# EAGLE schematic MSP-EXP430FR5994_EagleCAD (EAGLE 7.2.0)
DRAWN: Mike Stein; REV: 1.1

## Sheet 1 of 7
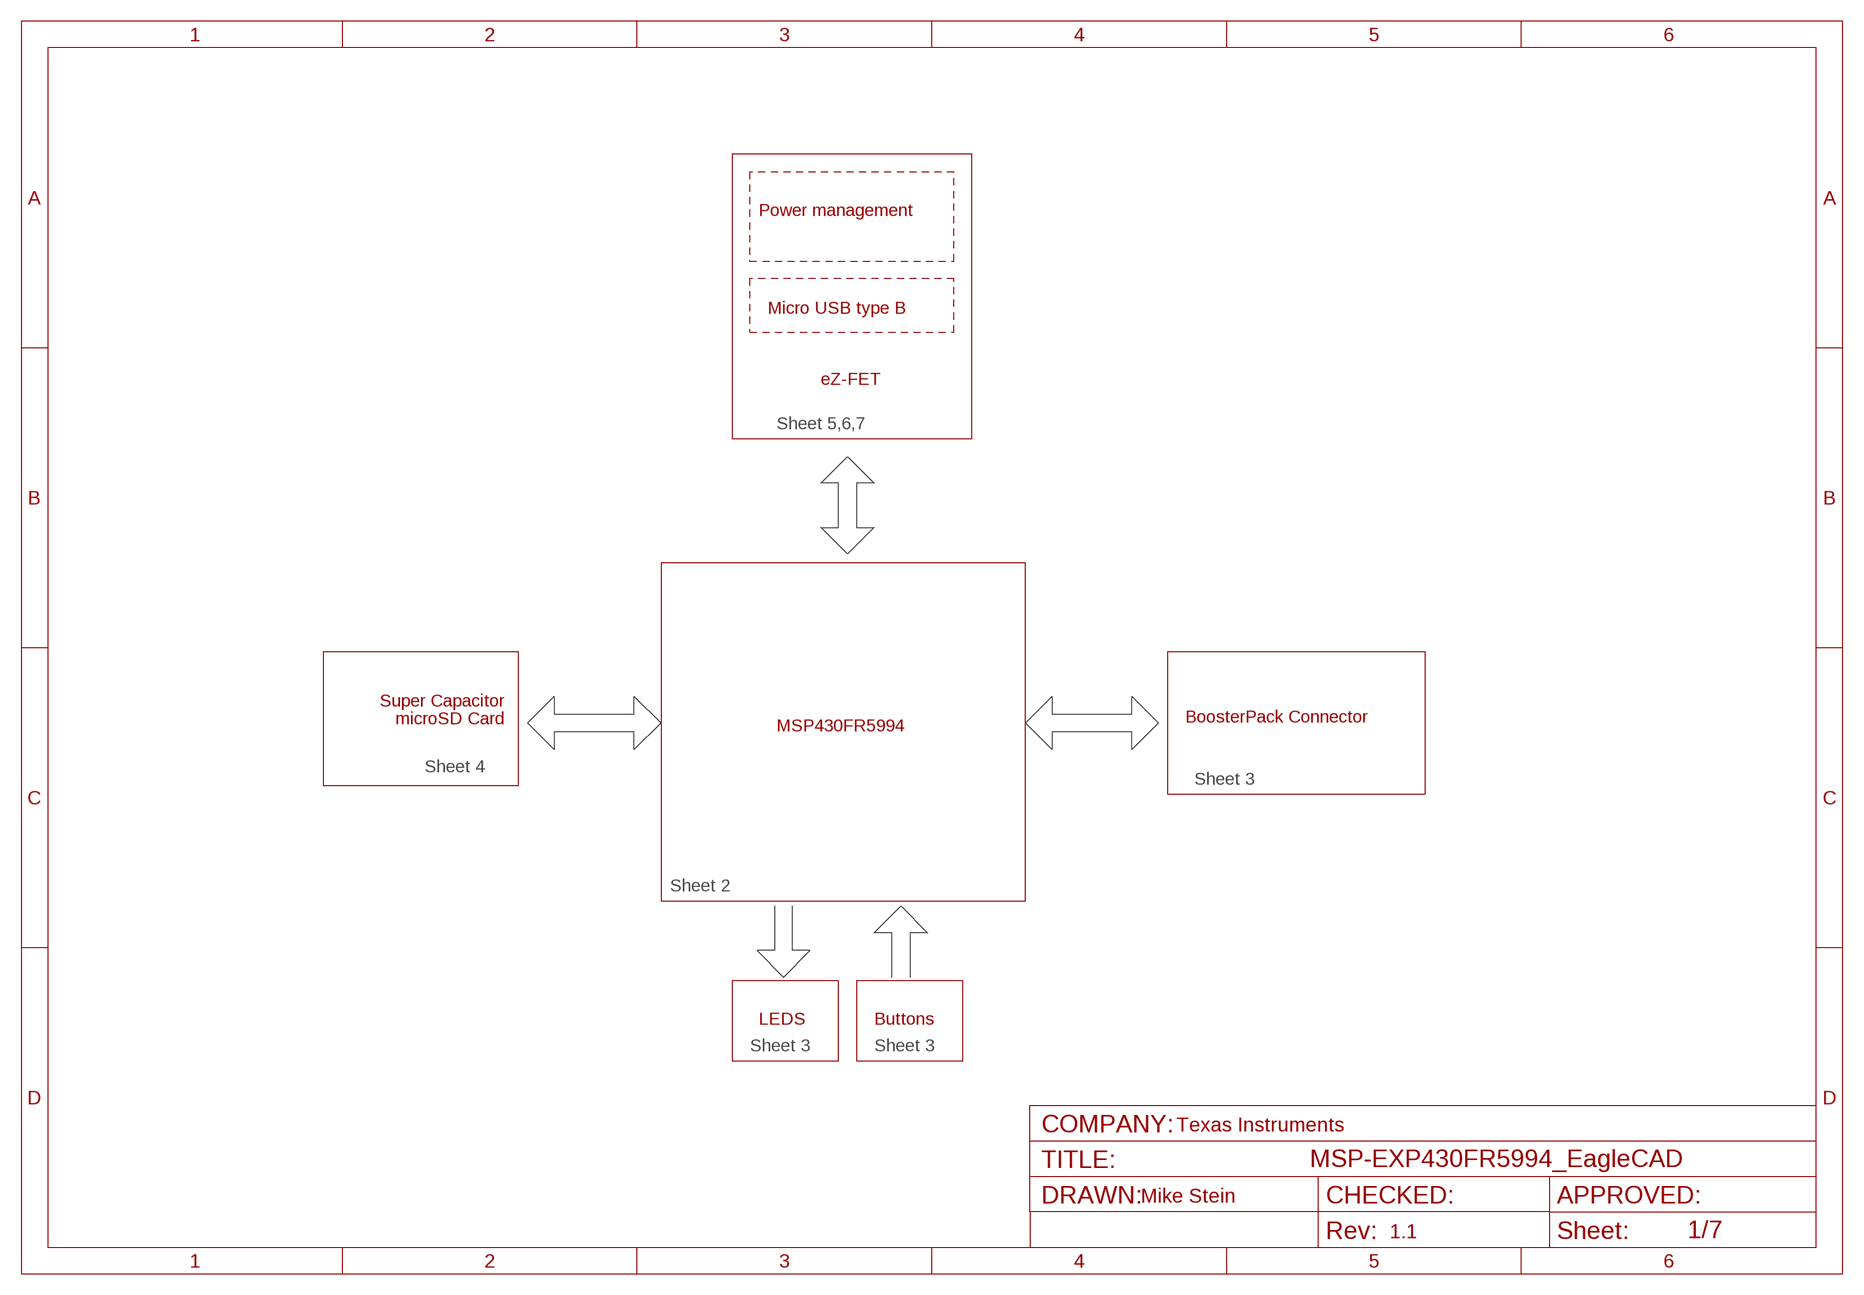
[diagram p0: schematic, sheet 1]

### Notes on the sheet
- Power management
- Micro USB type B
- eZ-FET
- Sheet 5,6,7
- Super Capacitor
- microSD Card
- BoosterPack Connector
- MSP430FR5994
- Sheet 4
- Sheet 3
- Sheet 2
- LEDS | Buttons
- Sheet 3 | Sheet 3
- Texas Instruments

## Sheet 2 of 7
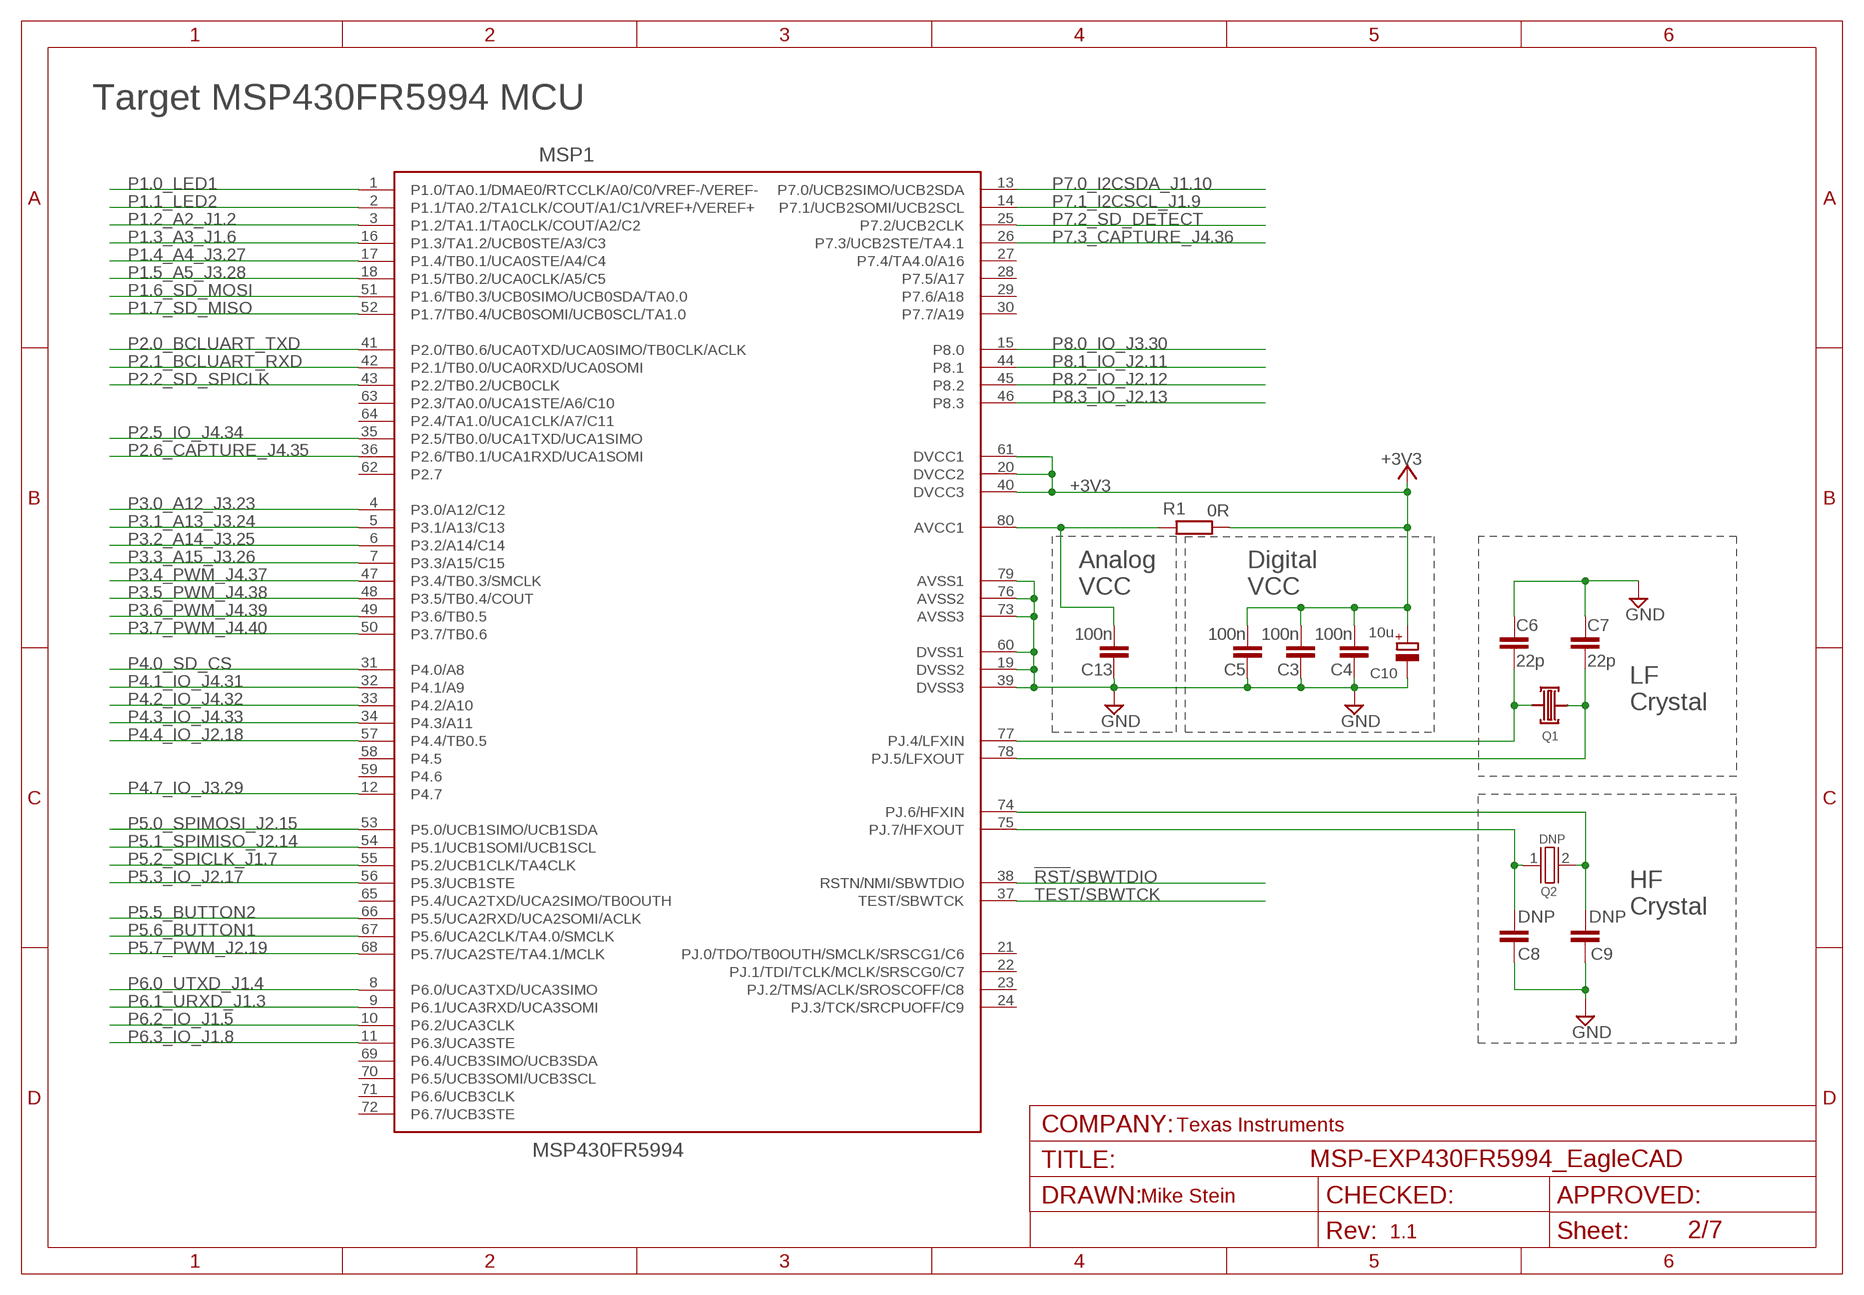
[diagram p1: schematic, sheet 2]

### Parts
C3  100n  C-EUCM0402  [0402]
C4  100n  C-EUCM0402  [0402]
C5  100n  C-EUCM0402  [0402]
C6  22p  C-EUCM0402  [0402]
C7  22p  C-EUCM0402  [0402]
C8  DNP  C-EUCM0402  [0402]
C9  DNP  C-EUCM0402  [0402]
C10  10u  CPOL-EUA/3216-18R  [A/3216-18R]
C13  100n  C-EUCM0402  [0402]
MSP1  MSP430FR5994  [PN80]
Q1  LF_CRYSTAL  [LF_CRYSTAL]
Q2  CRYSTALHF_GENERAL  [HF_XTAL]
R1  0R  R-EU_RM0402  [0402]

### Nets
!RST!/SBWTDIO: MSP1.38(RSTN/NMI/SBWTDIO) ; also sheet 3,6
+3V3: C3.1 C4.1 C5.1 C10.+ MSP1.20(DVCC2) MSP1.40(DVCC3) MSP1.61(DVCC1) R1.1 ; also sheet 3,4,6
N$2: C13.1 MSP1.80(AVCC1) R1.2
N$8: C7.1 MSP1.78(PJ.5/LFXOUT) Q1.2
N$10: C9.1 MSP1.74(PJ.6/HFXIN) Q2.2
N$11: C8.1 MSP1.75(PJ.7/HFXOUT) Q2.1
N$14: C6.1 MSP1.77(PJ.4/LFXIN) Q1.1
P1.0_LED1: MSP1.1(P1.0/TA0.1/DMAE0/RTCCLK/A0/C0/VREF-/VEREF-) ; also sheet 3
P1.1_LED2: MSP1.2(P1.1/TA0.2/TA1CLK/COUT/A1/C1/VREF+/VEREF+) ; also sheet 3
P1.2_A2_J1.2: MSP1.3(P1.2/TA1.1/TA0CLK/COUT/A2/C2) ; also sheet 3
P1.3_A3_J1.6: MSP1.16(P1.3/TA1.2/UCB0STE/A3/C3) ; also sheet 3
P1.4_A4_J3.27: MSP1.17(P1.4/TB0.1/UCA0STE/A4/C4) ; also sheet 3
P1.5_A5_J3.28: MSP1.18(P1.5/TB0.2/UCA0CLK/A5/C5) ; also sheet 3
P1.6_SD_MOSI: MSP1.51(P1.6/TB0.3/UCB0SIMO/UCB0SDA/TA0.0) ; also sheet 4
P1.7_SD_MISO: MSP1.52(P1.7/TB0.4/UCB0SOMI/UCB0SCL/TA1.0) ; also sheet 4
P2.0_BCLUART_TXD: MSP1.41(P2.0/TB0.6/UCA0TXD/UCA0SIMO/TB0CLK/ACLK) ; also sheet 6
P2.1_BCLUART_RXD: MSP1.42(P2.1/TB0.0/UCA0RXD/UCA0SOMI) ; also sheet 6
P2.2_SD_SPICLK: MSP1.43(P2.2/TB0.2/UCB0CLK) ; also sheet 4
P2.5_IO_J4.34: MSP1.35(P2.5/TB0.0/UCA1TXD/UCA1SIMO) ; also sheet 3
P2.6_CAPTURE_J4.35: MSP1.36(P2.6/TB0.1/UCA1RXD/UCA1SOMI) ; also sheet 3
P3.0_A12_J3.23: MSP1.4(P3.0/A12/C12) ; also sheet 3
P3.1_A13_J3.24: MSP1.5(P3.1/A13/C13) ; also sheet 3
P3.2_A14_J3.25: MSP1.6(P3.2/A14/C14) ; also sheet 3
P3.3_A15_J3.26: MSP1.7(P3.3/A15/C15) ; also sheet 3
P3.4_PWM_J4.37: MSP1.47(P3.4/TB0.3/SMCLK) ; also sheet 3
P3.5_PWM_J4.38: MSP1.48(P3.5/TB0.4/COUT) ; also sheet 3
P3.6_PWM_J4.39: MSP1.49(P3.6/TB0.5) ; also sheet 3
P3.7_PWM_J4.40: MSP1.50(P3.7/TB0.6) ; also sheet 3
P4.0_SD_CS: MSP1.31(P4.0/A8) ; also sheet 4
P4.1_IO_J4.31: MSP1.32(P4.1/A9) ; also sheet 3
P4.2_IO_J4.32: MSP1.33(P4.2/A10) ; also sheet 3
P4.3_IO_J4.33: MSP1.34(P4.3/A11) ; also sheet 3
P4.4_IO_J2.18: MSP1.57(P4.4/TB0.5) ; also sheet 3
P4.7_IO_J3.29: MSP1.12(P4.7) ; also sheet 3
P5.0_SPIMOSI_J2.15: MSP1.53(P5.0/UCB1SIMO/UCB1SDA) ; also sheet 3
P5.1_SPIMISO_J2.14: MSP1.54(P5.1/UCB1SOMI/UCB1SCL) ; also sheet 3
P5.2_SPICLK_J1.7: MSP1.55(P5.2/UCB1CLK/TA4CLK) ; also sheet 3
P5.3_IO_J2.17: MSP1.56(P5.3/UCB1STE) ; also sheet 3
P5.5_BUTTON2: MSP1.66(P5.5/UCA2RXD/UCA2SOMI/ACLK) ; also sheet 3
P5.6_BUTTON1: MSP1.67(P5.6/UCA2CLK/TA4.0/SMCLK) ; also sheet 3
P5.7_PWM_J2.19: MSP1.68(P5.7/UCA2STE/TA4.1/MCLK) ; also sheet 3
P6.0_UTXD_J1.4: MSP1.8(P6.0/UCA3TXD/UCA3SIMO) ; also sheet 3
P6.1_URXD_J1.3: MSP1.9(P6.1/UCA3RXD/UCA3SOMI) ; also sheet 3
P6.2_IO_J1.5: MSP1.10(P6.2/UCA3CLK) ; also sheet 3
P6.3_IO_J1.8: MSP1.11(P6.3/UCA3STE) ; also sheet 3
P7.0_I2CSDA_J1.10: MSP1.13(P7.0/UCB2SIMO/UCB2SDA) ; also sheet 3
P7.1_I2CSCL_J1.9: MSP1.14(P7.1/UCB2SOMI/UCB2SCL) ; also sheet 3
P7.2_SD_DETECT: MSP1.25(P7.2/UCB2CLK) ; also sheet 4
P7.3_CAPTURE_J4.36: MSP1.26(P7.3/UCB2STE/TA4.1) ; also sheet 3
P8.0_IO_J3.30: MSP1.15(P8.0) ; also sheet 3
P8.1_IO_J2.11: MSP1.44(P8.1) ; also sheet 3
P8.2_IO_J2.12: MSP1.45(P8.2) ; also sheet 3
P8.3_IO_J2.13: MSP1.46(P8.3) ; also sheet 3
TEST/SBWTCK: MSP1.37(TEST/SBWTCK) ; also sheet 6
TGT_GND: C3.2 C4.2 C5.2 C6.2 C7.2 C8.2 C9.2 C10.- C13.2 MSP1.19(DVSS2) MSP1.39(DVSS3) MSP1.60(DVSS1) MSP1.73(AVSS3) MSP1.76(AVSS2) MSP1.79(AVSS1) ; supply symbol labelled GND ; also sheet 3,4,6

### Notes on the sheet
- Target MSP430FR5994 MCU
- Analog | Digital
- VCC | VCC
- LF
- Crystal
- DNP
- HF
- Crystal
- Texas Instruments

## Sheet 3 of 7
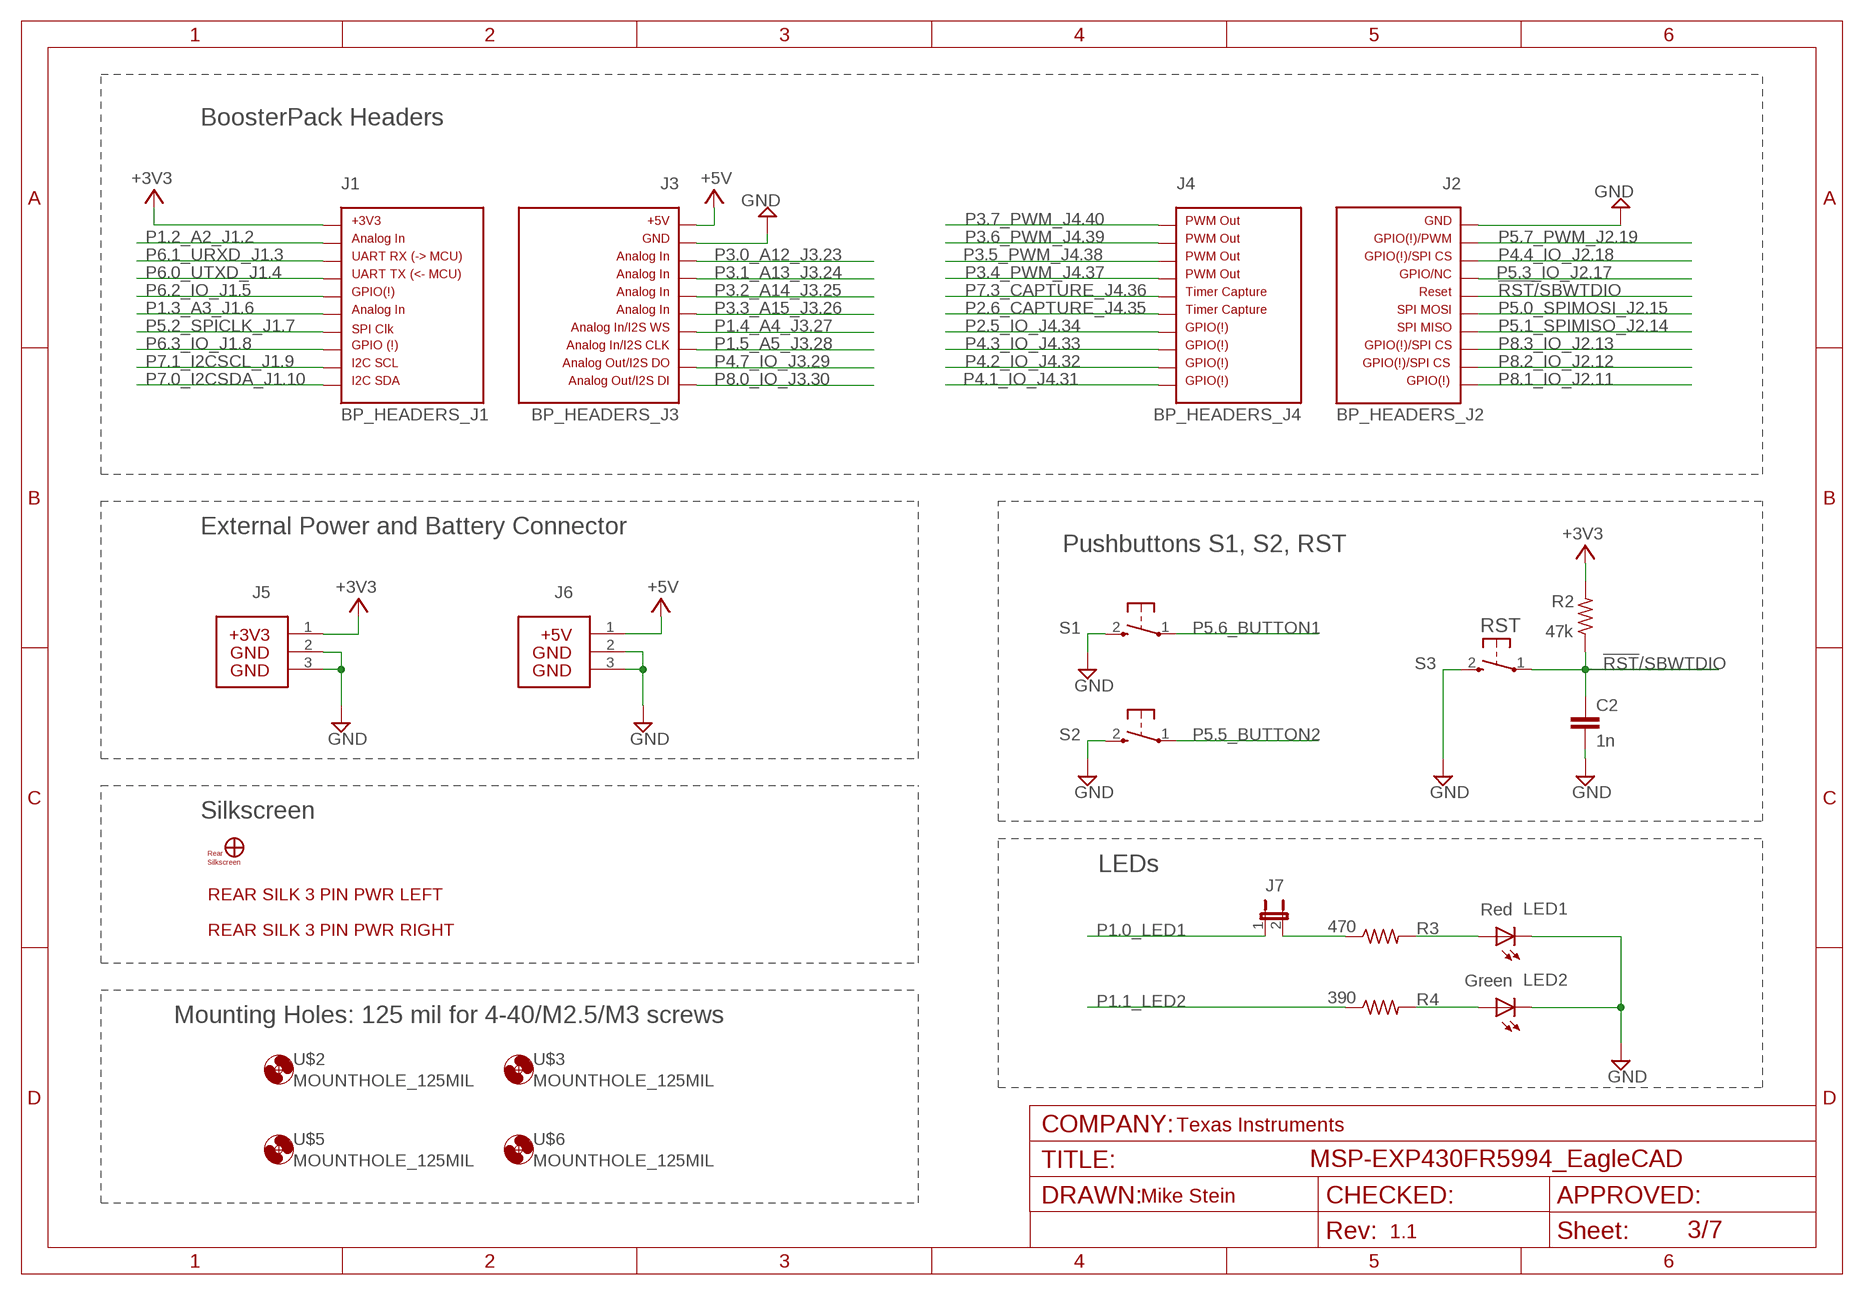
[diagram p2: schematic, sheet 3]

### Parts
C2  1n  C-EUCM0402  [0402]
J1  BP_HEADERS_J1  [J1]
J2  BP_HEADERS_J2  [J2]
J3  BP_HEADERS_J3  [J3]
J4  BP_HEADERS_J4  [J4]
J5  HEADER 1X03  BP_HEADERS_PWR_3V3100-TH  [3PIN_PWR_3V3]
J6  BP_HEADERS_PWR_5V  [3PIN_PWR_5V]
J7  JUMPER1X02  [1X02]
LED1  Red  CHIP-LED  [LED0805]
LED2  Green  CHIP-LED  [LED0805]
R2  47k  R-US_RM0402  [0402]
R3  470  R-US_RM0402  [0402]
R4  390  R-US_RM0402  [0402]
S1  PB  [PBTH]
S2  PB  [PBTH]
S3  PB  [PBTH]
U$1  FR5994_REARSILK_REV1_0  [FR5994_REARSILK_REV1_0]
U$2  MOUNTHOLE_125MIL  [MOUNTHOLE_125MIL]
U$3  MOUNTHOLE_125MIL  [MOUNTHOLE_125MIL]
U$5  MOUNTHOLE_125MIL  [MOUNTHOLE_125MIL]
U$6  MOUNTHOLE_125MIL  [MOUNTHOLE_125MIL]
U$7  MIKE_TM  [MIKE_TM]
U$8  BP_3PIN_SILK  [3PIN_PWR_SILK]
U$10  BP_3PIN_SILK_RT  [3PIN_PWR_SILK_RT]

### Nets
!RST!/SBWTDIO: C2.1 J2.16 R2.1 S3.1(P) ; also sheet 2,6
+3V3: J1.1 J5.1 R2.2 ; also sheet 2,4,6
+5V: J3.21 J6.1 ; also sheet 6
N$4: LED2.A R4.2
N$6: J7.2 R3.1
N$7: LED1.A R3.2
P1.0_LED1: J7.1 ; also sheet 2
P1.1_LED2: R4.1 ; also sheet 2
P1.2_A2_J1.2: J1.2 ; also sheet 2
P1.3_A3_J1.6: J1.6 ; also sheet 2
P1.4_A4_J3.27: J3.27 ; also sheet 2
P1.5_A5_J3.28: J3.28 ; also sheet 2
P2.5_IO_J4.34: J4.34 ; also sheet 2
P2.6_CAPTURE_J4.35: J4.35 ; also sheet 2
P3.0_A12_J3.23: J3.23 ; also sheet 2
P3.1_A13_J3.24: J3.24 ; also sheet 2
P3.2_A14_J3.25: J3.25 ; also sheet 2
P3.3_A15_J3.26: J3.26 ; also sheet 2
P3.4_PWM_J4.37: J4.37 ; also sheet 2
P3.5_PWM_J4.38: J4.38 ; also sheet 2
P3.6_PWM_J4.39: J4.39 ; also sheet 2
P3.7_PWM_J4.40: J4.40 ; also sheet 2
P4.1_IO_J4.31: J4.31 ; also sheet 2
P4.2_IO_J4.32: J4.32 ; also sheet 2
P4.3_IO_J4.33: J4.33 ; also sheet 2
P4.4_IO_J2.18: J2.18 ; also sheet 2
P4.7_IO_J3.29: J3.29 ; also sheet 2
P5.0_SPIMOSI_J2.15: J2.15 ; also sheet 2
P5.1_SPIMISO_J2.14: J2.14 ; also sheet 2
P5.2_SPICLK_J1.7: J1.7 ; also sheet 2
P5.3_IO_J2.17: J2.17 ; also sheet 2
P5.5_BUTTON2: S2.1(P) ; also sheet 2
P5.6_BUTTON1: S1.1(P) ; also sheet 2
P5.7_PWM_J2.19: J2.19 ; also sheet 2
P6.0_UTXD_J1.4: J1.4 ; also sheet 2
P6.1_URXD_J1.3: J1.3 ; also sheet 2
P6.2_IO_J1.5: J1.5 ; also sheet 2
P6.3_IO_J1.8: J1.8 ; also sheet 2
P7.0_I2CSDA_J1.10: J1.10 ; also sheet 2
P7.1_I2CSCL_J1.9: J1.9 ; also sheet 2
P7.3_CAPTURE_J4.36: J4.36 ; also sheet 2
P8.0_IO_J3.30: J3.30 ; also sheet 2
P8.1_IO_J2.11: J2.11 ; also sheet 2
P8.2_IO_J2.12: J2.12 ; also sheet 2
P8.3_IO_J2.13: J2.13 ; also sheet 2
TGT_GND: C2.2 J2.20 J3.22 J5.2 J5.3 J6.2 J6.3 LED1.C LED2.C S1.2(S) S2.2(S) S3.2(S) ; supply symbol labelled GND ; also sheet 2,4,6

### Notes on the sheet
- BoosterPack Headers
- External Power and Battery Connector
- Pushbuttons S1, S2, RST
- RST
- Silkscreen
- LEDs
- Mounting Holes: 125 mil for 4-40/M2.5/M3 screws
- Texas Instruments

## Sheet 4 of 7
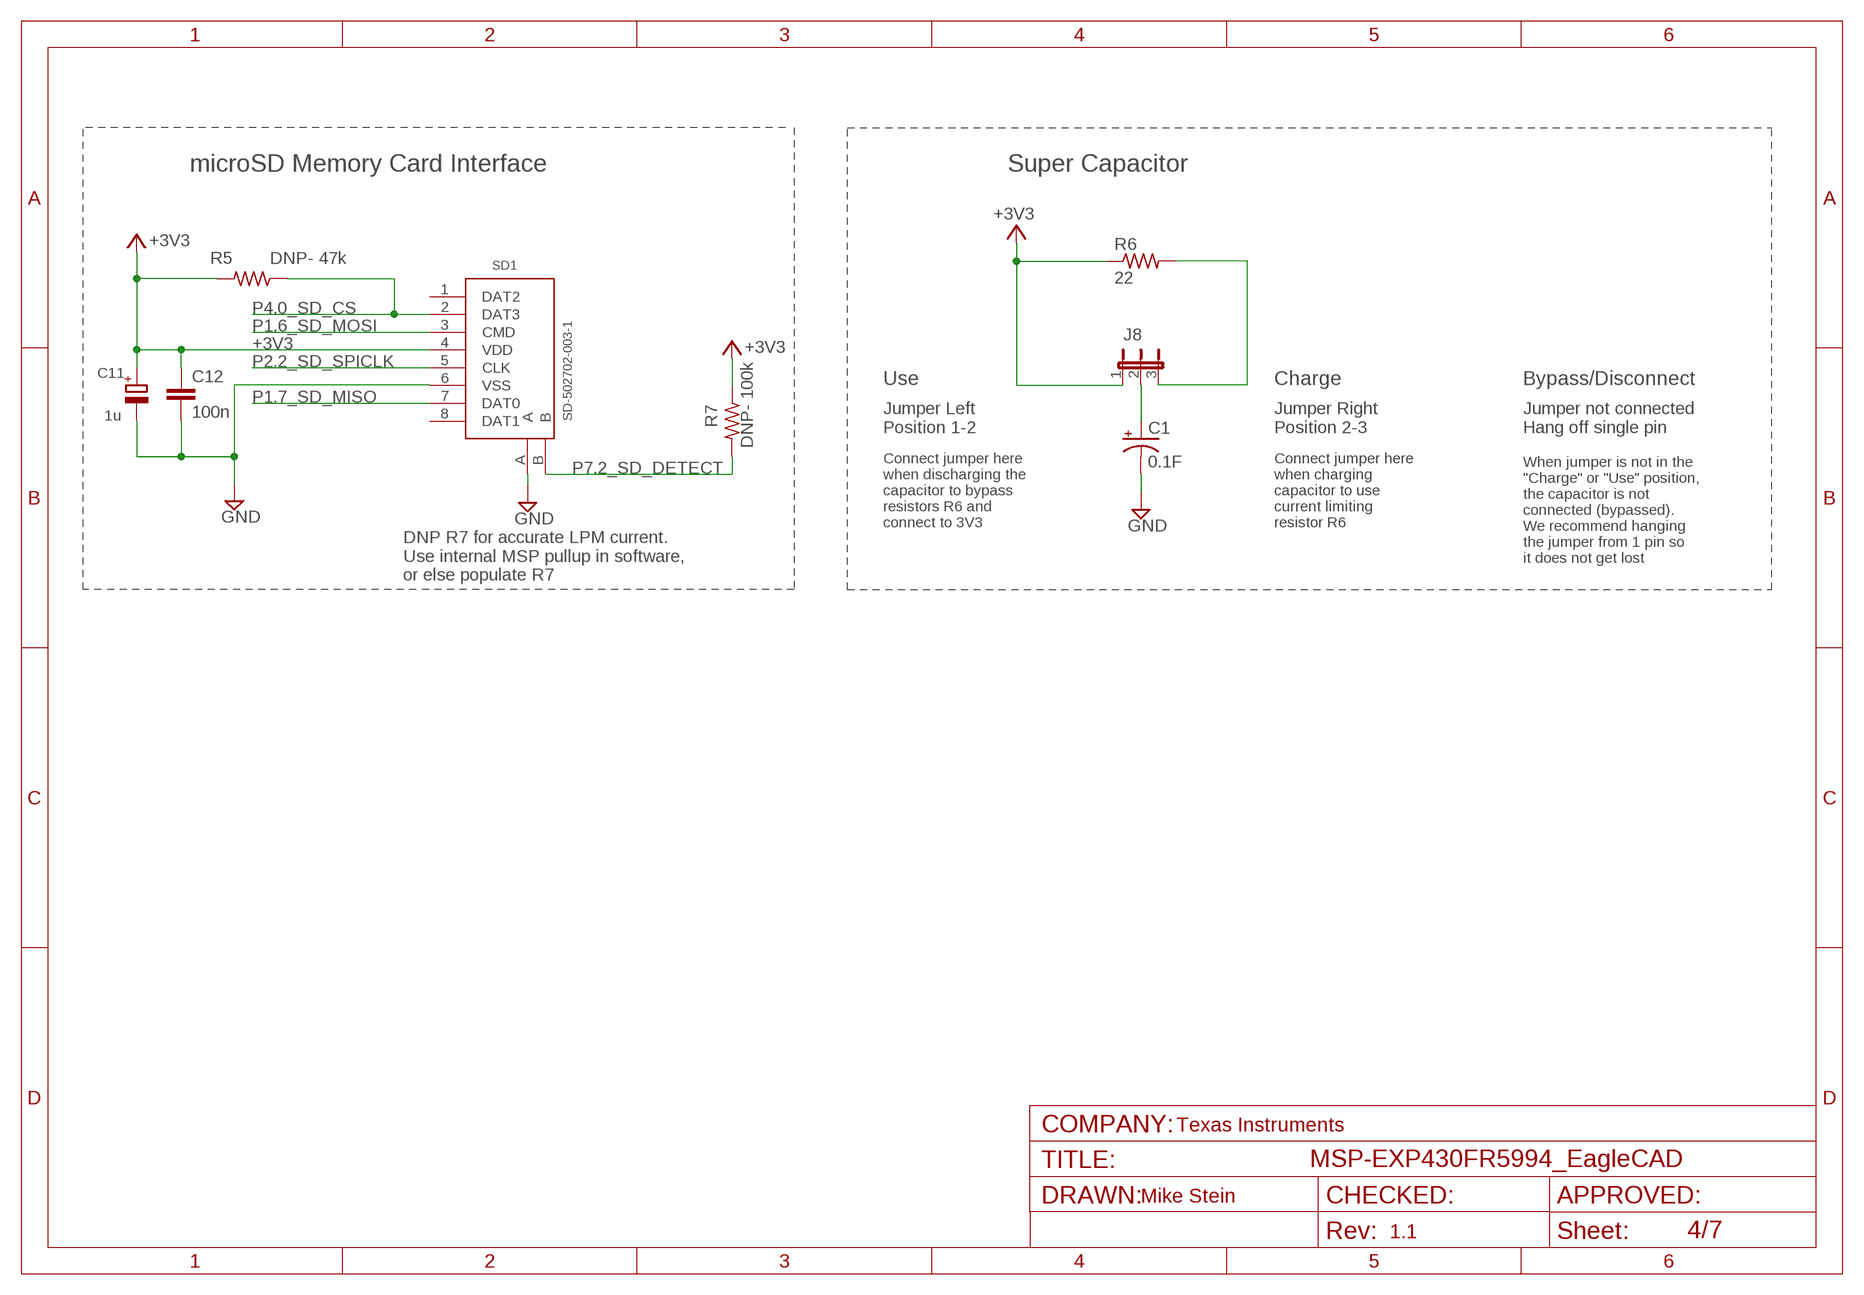
[diagram p3: schematic, sheet 4]

### Parts
C1  0.1F  PANASONIC_SUPERCAP  [PANASONIC_SUPERCAP]
C11  1u  CPOL-EUA/3216-18R  [A/3216-18R]
C12  100n  C-EUCM0402  [0402]
J8  JUMPER1X03  [1X03]
R5  DNP- 47k  R-US_RM0402  [0402]
R6  22  R-US_R3216  [R3216]
R7  DNP- 100k  R-US_RM0402  [0402]
SD1  SD-502702-003-1  [SD-502702-003]

### Nets
+3V3: C11.+ C12.1 J8.1 R5.2 R6.1 R7.1 SD1.4(VDD) ; also sheet 2,3,6
N$3: C1.+ J8.2
N$17: J8.3 R6.2
P1.6_SD_MOSI: SD1.3(CMD) ; also sheet 2
P1.7_SD_MISO: SD1.7(DAT0) ; also sheet 2
P2.2_SD_SPICLK: SD1.5(CLK) ; also sheet 2
P4.0_SD_CS: R5.1 SD1.2(DAT3) ; also sheet 2
P7.2_SD_DETECT: R7.2 SD1.B ; also sheet 2
TGT_GND: C1.- C11.- C12.2 SD1.6(VSS) SD1.A ; supply symbol labelled GND ; also sheet 2,3,6
Unconnected: SD1.1(DAT2) SD1.8(DAT1)

### Notes on the sheet
- microSD Memory Card Interface | Super Capacitor
- Use | Charge | Bypass/Disconnect
- Jumper Left
  Position 1-2
- Jumper Right
  Position 2-3
- Jumper not connected
  Hang off single pin
- Connect jumper here
  when discharging the
  capacitor to bypass
  resistors R6 and
  connect to 3V3
- Connect jumper here
  when charging
  capacitor to use
  current limiting
  resistor R6
- When jumper is not in the
  "Charge" or "Use" position,
  the capacitor is not
  connected (bypassed).
  We recommend hanging
  the jumper from 1 pin so
  it does not get lost
- DNP R7 for accurate LPM current. 
  Use internal MSP pullup in software, 
  or else populate R7
- Texas Instruments

## Sheet 5 of 7
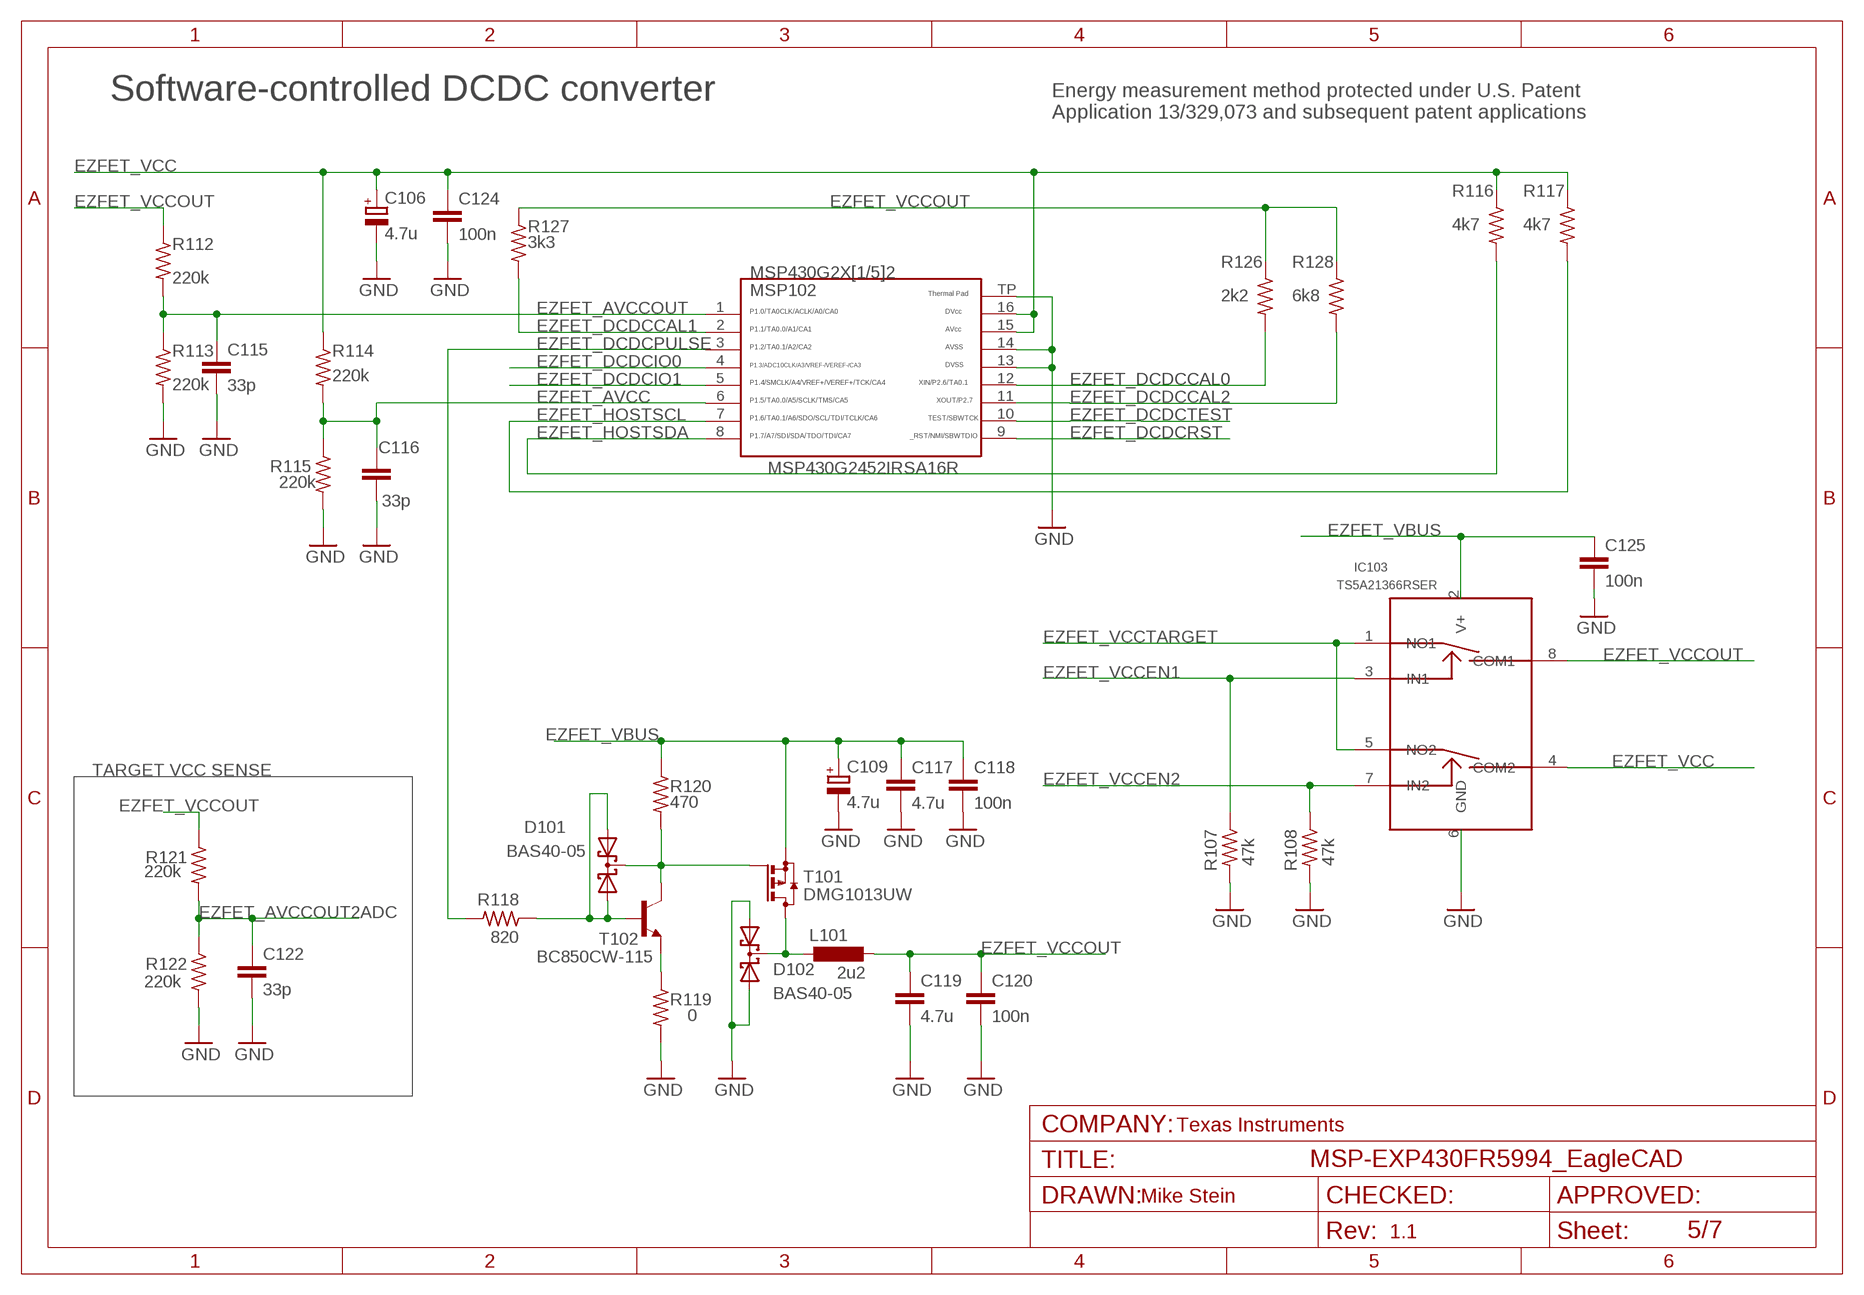
[diagram p4: schematic, sheet 5]

### Parts
C106  4.7u  CPOL-EUA/3216-18R  [A/3216-18R]
C109  4.7u  CPOL-EUA/3216-18R  [A/3216-18R]
C115  33p  C-EUCM0402  [0402]
C116  33p  C-EUCM0402  [0402]
C117  4.7u  C-EUC0603  [C0603]
C118  100n  C-EUCM0402  [0402]
C119  4.7u  C-EUC0603  [C0603]
C120  100n  C-EUCM0402  [0402]
C122  33p  C-EUCM0402  [0402]
C124  100n  C-EUCM0402  [0402]
C125  100n  C-EUCM0402  [0402]
D101  BAS40-05  BAS40-05W  [SOT323]
D102  BAS40-05  BAS40-05W  [SOT323]
IC103  TS5A21366RSER  [UQFN_RSE]
L101  2u2  L-EUL3216C  [L3216C]
MSP102  MSP430G2452IRSA16R  G2X[1/5]2---RSA16  [RSA16]
R107  47k  R-US_RM0402  [0402]
R108  47k  R-US_RM0402  [0402]
R112  220k  R-US_RM0402  [0402]
R113  220k  R-US_RM0402  [0402]
R114  220k  R-US_RM0402  [0402]
R115  220k  R-US_RM0402  [0402]
R116  4k7  R-US_RM0402  [0402]
R117  4k7  R-US_RM0402  [0402]
R118  820  R-US_RM0402  [0402]
R119  0  R-US_RM0402  [0402]
R120  470  R-US_RM0402  [0402]
R121  220k  R-US_RM0402  [0402]
R122  220k  R-US_RM0402  [0402]
R126  2k2  R-US_RM0402  [0402]
R127  3k3  R-US_RM0402  [0402]
R128  6k8  R-US_RM0402  [0402]
T101  DMG1013UW  [SOT323]
T102  BC850CW-115  [SOT323]

### Nets
EZFET_AVCC: C116.2 MSP102.6 R114.2 R115.1
EZFET_AVCCOUT: C115.2 MSP102.1 R112.2 R113.1
EZFET_AVCCOUT2ADC: C122.2 R121.2 R122.1 ; also sheet 6
EZFET_DCDCCAL0: MSP102.12 R126.2
EZFET_DCDCCAL1: MSP102.2 R127.2
EZFET_DCDCCAL2: MSP102.11 R128.2
EZFET_DCDCIO0: MSP102.4 ; also sheet 6
EZFET_DCDCIO1: MSP102.5 ; also sheet 6
EZFET_DCDCPULSE: MSP102.3 R118.2 ; also sheet 6
EZFET_DCDCRST: MSP102.9 ; also sheet 6,7
EZFET_DCDCTEST: MSP102.10 ; also sheet 6,7
EZFET_HOSTSCL: MSP102.7 R117.2 ; also sheet 6
EZFET_HOSTSDA: MSP102.8 R116.2 ; also sheet 6
EZFET_VBUS: C109.+ C117.1 C118.1 C125.1 IC103.2(V+) R120.1 T101.2(S) ; also sheet 6,7
EZFET_VCC: C106.+ C124.1 IC103.4(COM2) MSP102.15 MSP102.16 R114.1 R116.1 R117.1 ; also sheet 6,7
EZFET_VCCEN1: IC103.3(IN1) R107.1 ; also sheet 6
EZFET_VCCEN2: IC103.7(IN2) R108.1 ; also sheet 6
EZFET_VCCOUT: C119.1 C120.1 IC103.8(COM1) L101.2 R112.1 R121.1 R126.1 R127.1 R128.1
EZFET_VCCTARGET: IC103.1(NO1) IC103.5(NO2) ; also sheet 6
GND: C106.- C109.- C115.1 C116.1 C117.2 C118.2 C119.2 C120.2 C122.1 C124.2 C125.2 D102.1(A1) D102.2(A2) IC103.6(GND) MSP102.13 MSP102.14 MSP102.TP R107.2 R108.2 R113.2 R115.2 R119.2 R122.2 ; also sheet 6,7
N$12: R119.1 T102.2(E)
N$13: D101.1(A1) D101.2(A2) R118.1 T102.1(B)
N$15: D102.3(C) L101.1 T101.3(D)
N$16: D101.3(C) R120.2 T101.1(G) T102.3(C)

### Notes on the sheet
- Software-controlled DCDC converter
- Energy measurement method protected under U.S. Patent 
  Application 13/329,073 and subsequent patent applications
- MSP430G2452IRSA16R
- TARGET VCC SENSE
- Texas Instruments

## Sheet 6 of 7
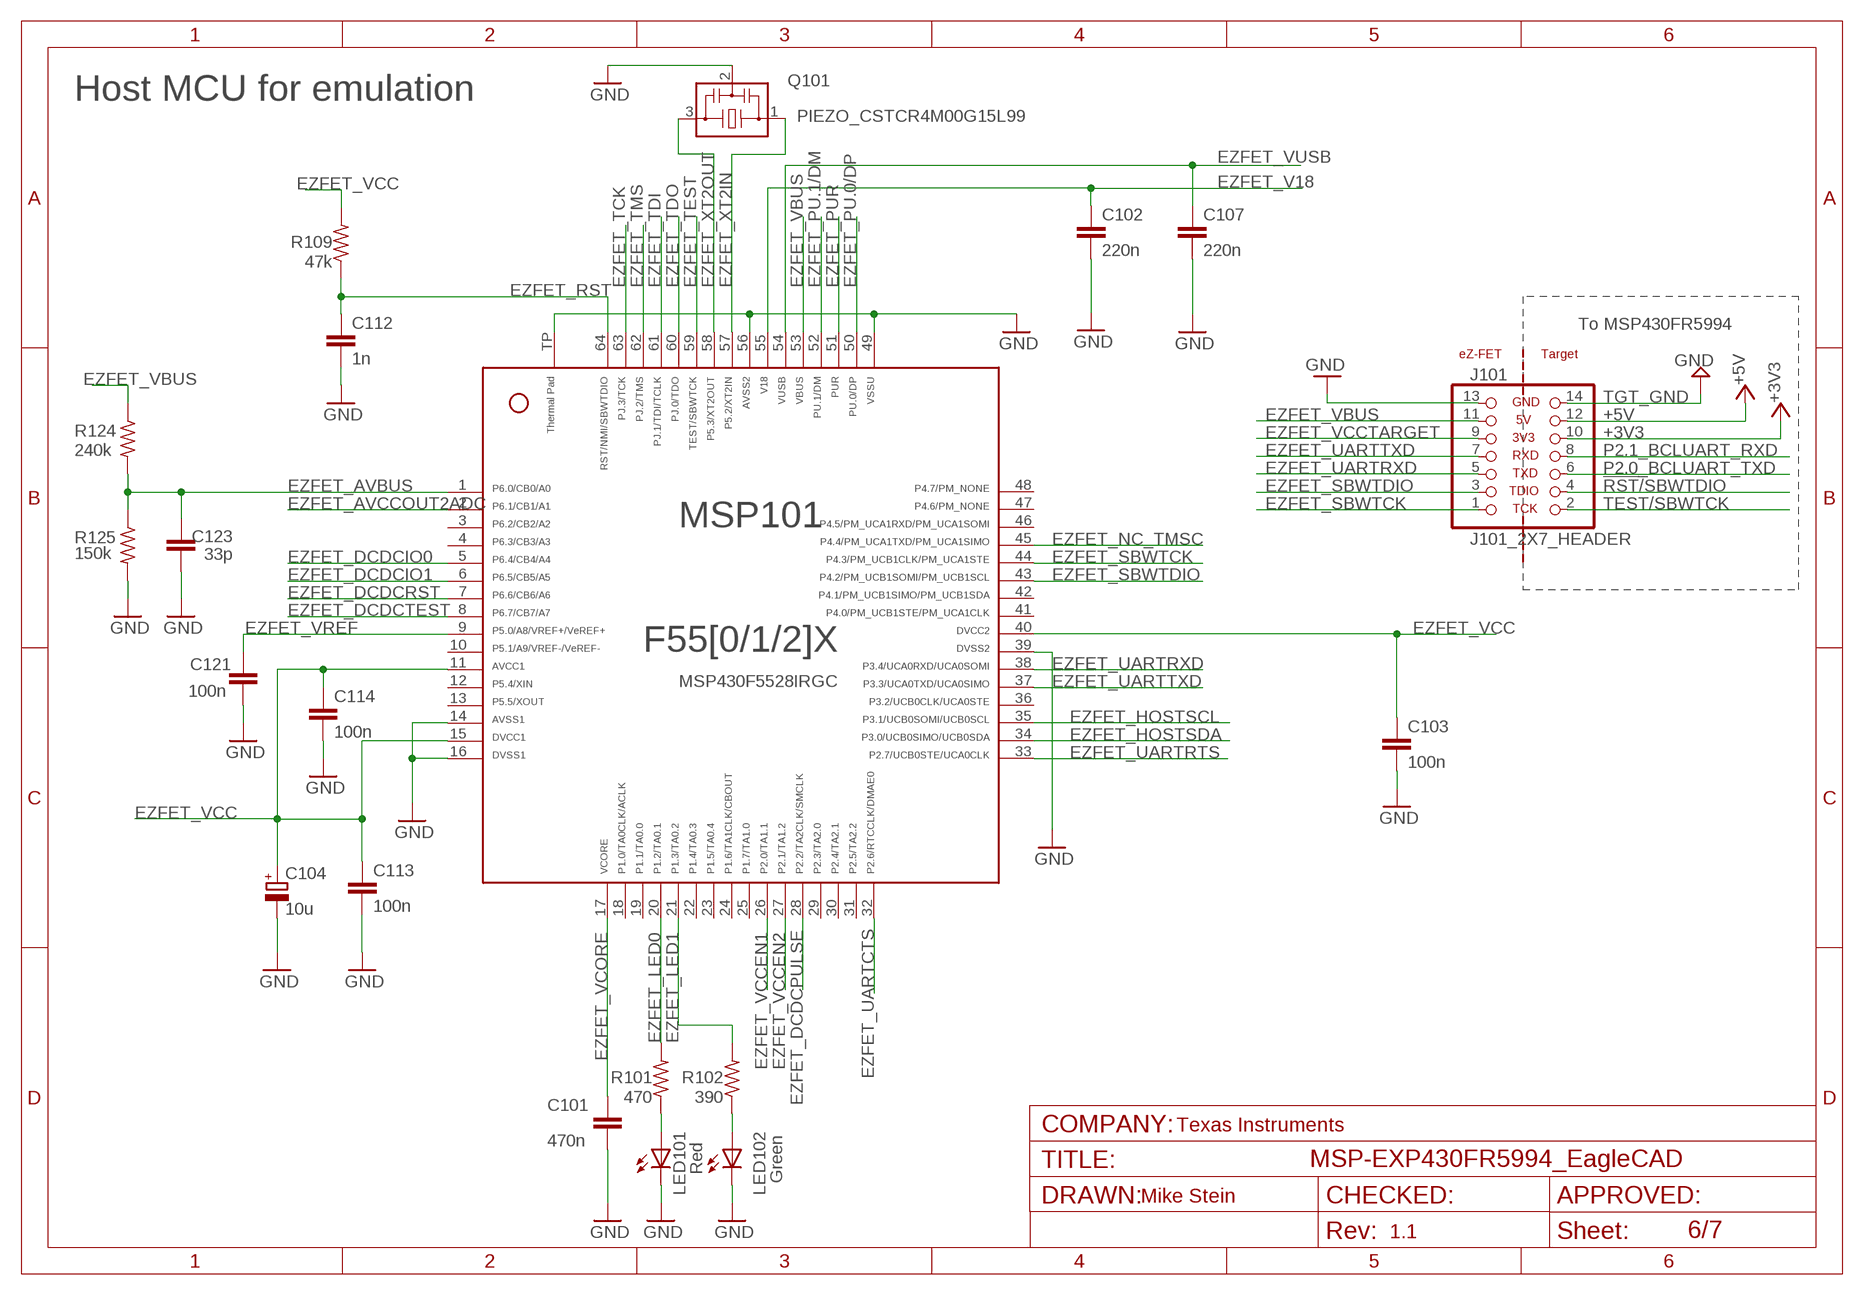
[diagram p5: schematic, sheet 6]

### Parts
C101  470n  C-EUCM0402  [0402]
C102  220n  C-EUCM0402  [0402]
C103  100n  C-EUCM0402  [0402]
C104  10u  CPOL-EUA/3216-18R  [A/3216-18R]
C107  220n  C-EUCM0402  [0402]
C112  1n  C-EUCM0402  [0402]
C113  100n  C-EUCM0402  [0402]
C114  100n  C-EUCM0402  [0402]
C121  100n  C-EUCM0402  [0402]
C123  33p  C-EUCM0402  [0402]
J101  J101_2X7_HEADER  [J101]
LED101  Red  CHIP-LED  [LED0805]
LED102  Green  CHIP-LED  [LED0805]
MSP101  MSP430F5528IRGC  F55[0/1/2]X---RGC64  [RGC64]
Q101  PIEZO_CSTCR4M00G15L99  CSTCR4M  [CSTCR4M]
R101  470  R-US_RM0402  [0402]
R102  390  R-US_RM0402  [0402]
R109  47k  R-US_RM0402  [0402]
R124  240k  R-US_RM0402  [0402]
R125  150k  R-US_RM0402  [0402]

### Nets
!RST!/SBWTDIO: J101.4 ; also sheet 2,3
+3V3: J101.10 ; also sheet 2,3,4
+5V: J101.12 ; also sheet 3
EZFET_AVBUS: C123.2 MSP101.1 R124.2 R125.1
EZFET_AVCCOUT2ADC: MSP101.2 ; also sheet 5
EZFET_DCDCIO0: MSP101.5 ; also sheet 5
EZFET_DCDCIO1: MSP101.6 ; also sheet 5
EZFET_DCDCPULSE: MSP101.28 ; also sheet 5
EZFET_DCDCRST: MSP101.7 ; also sheet 5,7
EZFET_DCDCTEST: MSP101.8 ; also sheet 5,7
EZFET_HOSTSCL: MSP101.35 ; also sheet 5
EZFET_HOSTSDA: MSP101.34 ; also sheet 5
EZFET_LED0: MSP101.20 R101.2
EZFET_LED1: MSP101.21 R102.2
EZFET_NC_TMSC: MSP101.45
EZFET_PU.0/DP: MSP101.50 ; also sheet 7
EZFET_PU.1/DM: MSP101.52 ; also sheet 7
EZFET_PUR: MSP101.51 ; also sheet 7
EZFET_RST: C112.1 MSP101.64 R109.1 ; also sheet 7
EZFET_SBWTCK: J101.1 MSP101.44
EZFET_SBWTDIO: J101.3 MSP101.43
EZFET_TCK: MSP101.63 ; also sheet 7
EZFET_TDI: MSP101.61 ; also sheet 7
EZFET_TDO: MSP101.60 ; also sheet 7
EZFET_TEST: MSP101.59 ; also sheet 7
EZFET_TMS: MSP101.62 ; also sheet 7
EZFET_UARTCTS: MSP101.32
EZFET_UARTRTS: MSP101.33
EZFET_UARTRXD: J101.5 MSP101.38
EZFET_UARTTXD: J101.7 MSP101.37
EZFET_V18: C102.1 MSP101.55
EZFET_VBUS: J101.11 MSP101.53 R124.1 ; also sheet 5,7
EZFET_VCC: C103.1 C104.+ C113.1 C114.1 MSP101.11 MSP101.15 MSP101.40 R109.2 ; also sheet 5,7
EZFET_VCCEN1: MSP101.26 ; also sheet 5
EZFET_VCCEN2: MSP101.27 ; also sheet 5
EZFET_VCCTARGET: J101.9 ; also sheet 5
EZFET_VCORE: C101.1 MSP101.17
EZFET_VREF: C121.1 MSP101.9
EZFET_VUSB: C107.1 MSP101.54
EZFET_XT2IN: MSP101.57 Q101.1
EZFET_XT2OUT: MSP101.58 Q101.3
GND: C101.2 C102.2 C103.2 C104.- C107.2 C112.2 C113.2 C114.2 C121.2 C123.1 J101.13 LED101.C LED102.C MSP101.14 MSP101.16 MSP101.39 MSP101.49 MSP101.56 MSP101.TP Q101.2 R125.2 ; also sheet 5,7
N$9: LED101.A R101.1
N$20: LED102.A R102.1
P2.0_BCLUART_TXD: J101.6 ; also sheet 2
P2.1_BCLUART_RXD: J101.8 ; also sheet 2
TEST/SBWTCK: J101.2 ; also sheet 2
TGT_GND: J101.14 ; supply symbol labelled GND ; also sheet 2,3,4
Unconnected: MSP101.3 MSP101.4 MSP101.10 MSP101.12 MSP101.13 MSP101.18 MSP101.19 MSP101.22 MSP101.23 MSP101.24 MSP101.25 MSP101.29 MSP101.30 MSP101.31 MSP101.36 MSP101.41 MSP101.42 MSP101.46 MSP101.47 MSP101.48

### Notes on the sheet
- Host MCU for emulation
- To MSP430FR5994
- MSP430F5528IRGC
- Texas Instruments

## Sheet 7 of 7
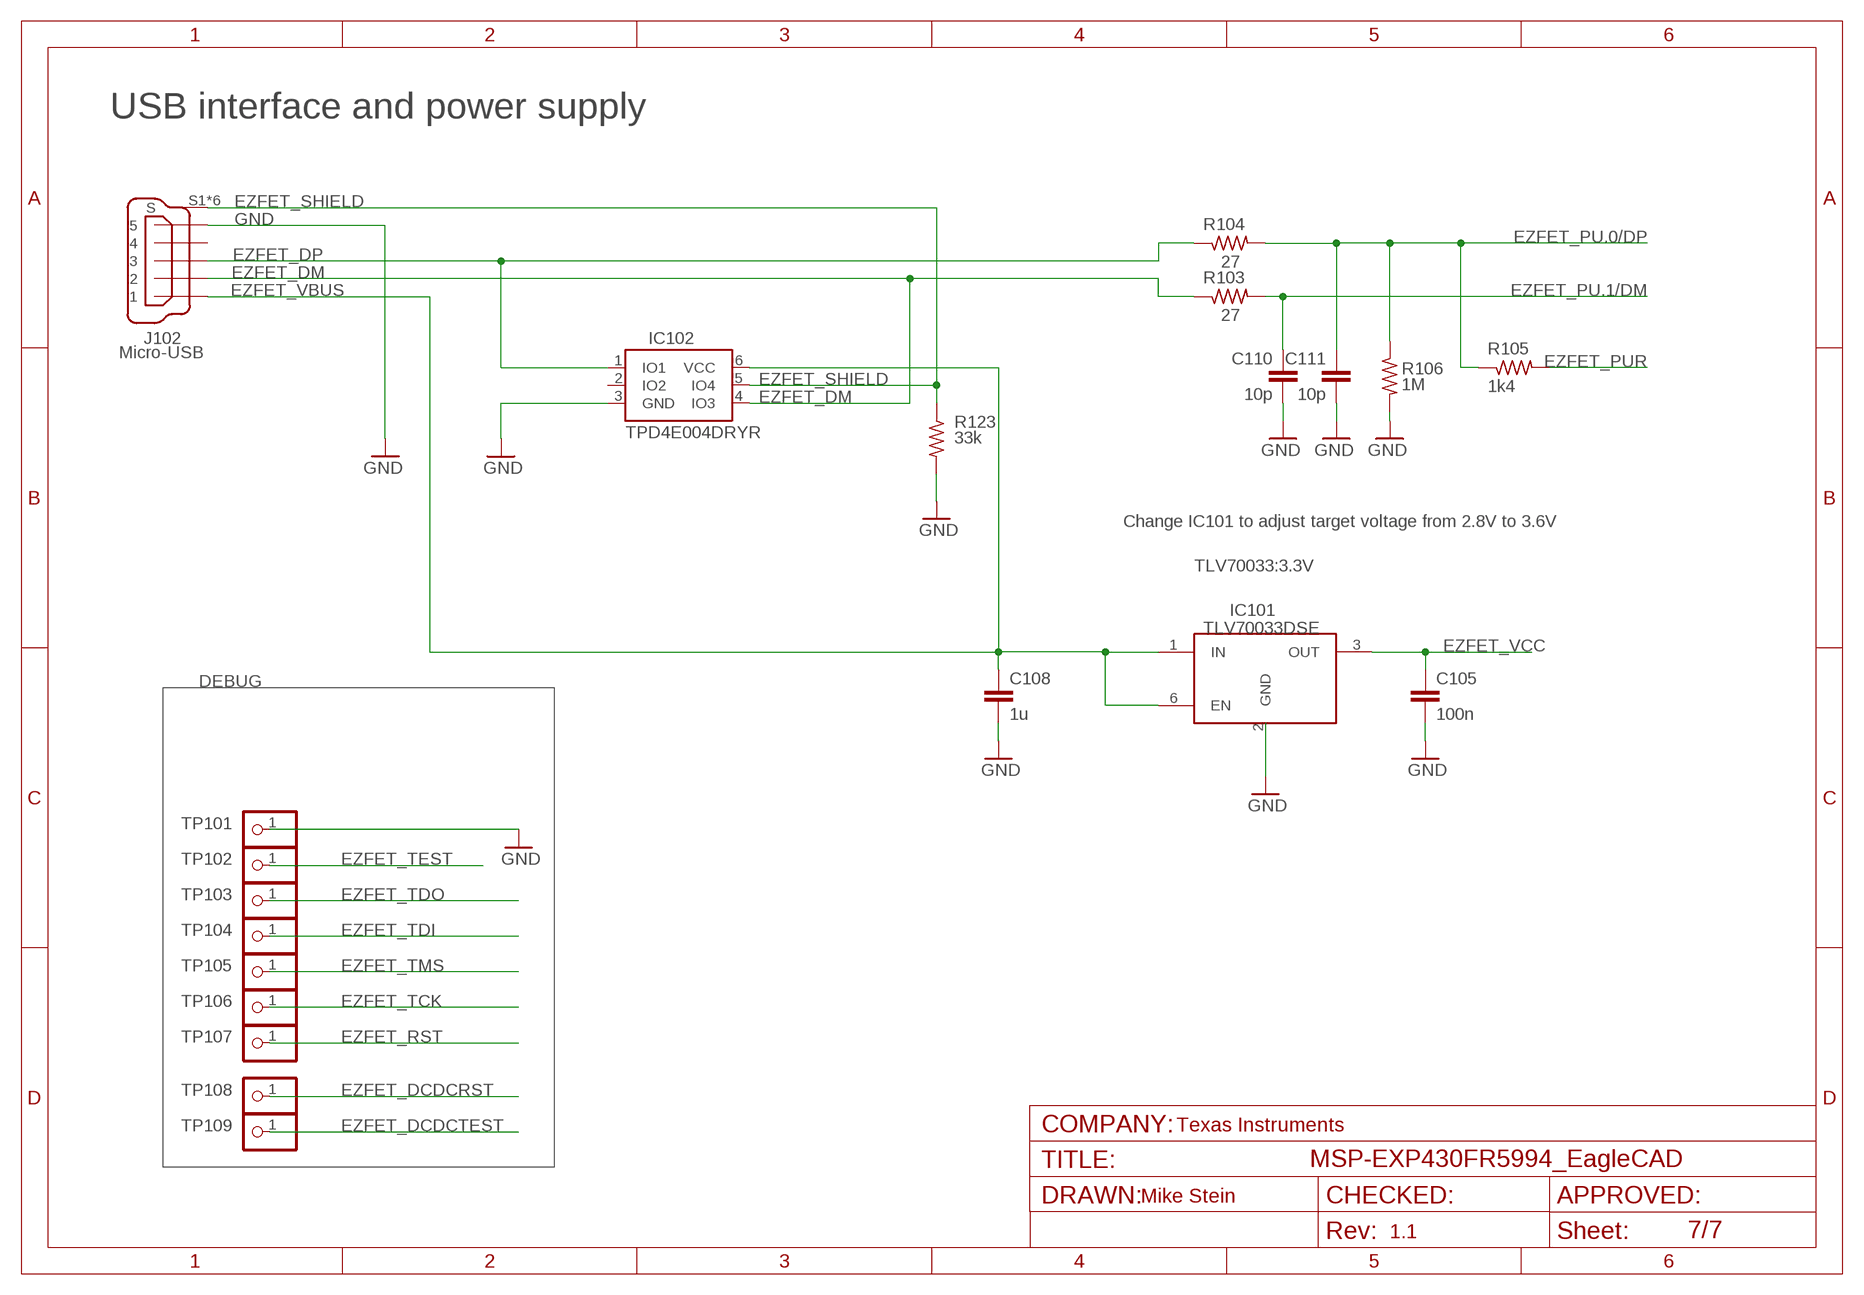
[diagram p6: schematic, sheet 7]

### Parts
C105  100n  C-EUCM0402  [0402]
C108  1u  C-EUC0603  [C0603]
C110  10p  C-EUCM0402  [0402]
C111  10p  C-EUCM0402  [0402]
IC101  TLV70033DSE  [WSON_DSE]
IC102  TPD4E004DRYR  TPD4E004  [SON(DRY)6]
J102  Micro-USB  EZFET_MINI-USB-  [EZFET_UX62M-B-5P]
R103  27  R-US_RM0402  [0402]
R104  27  R-US_RM0402  [0402]
R105  1k4  R-US_RM0402  [0402]
R106  1M  R-US_RM0402  [0402]
R123  33k  R-US_RM0402  [0402]
TP101  TEST_PIN2  PINHD-1X1  [1X01]
TP102  TEST_PIN2  PINHD-1X1  [1X01]
TP103  TEST_PIN2  PINHD-1X1  [1X01]
TP104  TEST_PIN2  PINHD-1X1  [1X01]
TP105  TEST_PIN2  PINHD-1X1  [1X01]
TP106  TEST_PIN2  PINHD-1X1  [1X01]
TP107  TEST_PIN2  PINHD-1X1  [1X01]
TP108  TEST_PIN2  PINHD-1X1  [1X01]
TP109  TEST_PIN2  PINHD-1X1  [1X01]

### Nets
EZFET_DCDCRST: TP108.1 ; also sheet 5,6
EZFET_DCDCTEST: TP109.1 ; also sheet 5,6
EZFET_DM: IC102.4(IO3) J102.2 R103.1
EZFET_DP: IC102.1(IO1) J102.3 R104.1
EZFET_PU.0/DP: C111.1 R104.2 R105.1 R106.1 ; also sheet 6
EZFET_PU.1/DM: C110.1 R103.2 ; also sheet 6
EZFET_PUR: R105.2 ; also sheet 6
EZFET_RST: TP107.1 ; also sheet 6
EZFET_SHIELD: IC102.5(IO4) J102.S1(S) J102.S2(S) J102.S3(S) J102.S4(S) J102.S5(S) J102.S6(S) R123.1
EZFET_TCK: TP106.1 ; also sheet 6
EZFET_TDI: TP104.1 ; also sheet 6
EZFET_TDO: TP103.1 ; also sheet 6
EZFET_TEST: TP102.1 ; also sheet 6
EZFET_TMS: TP105.1 ; also sheet 6
EZFET_VBUS: C108.1 IC101.1(IN) IC101.6(EN) IC102.6(VCC) J102.1 ; also sheet 5,6
EZFET_VCC: C105.1 IC101.3(OUT) ; also sheet 5,6
GND: C105.2 C108.2 C110.2 C111.2 IC101.2(GND) IC102.3(GND) J102.5 R106.2 R123.2 TP101.1 ; also sheet 5,6
Unconnected: IC102.2(IO2) J102.4

### Notes on the sheet
- USB interface and power supply
- Change IC101 to adjust target voltage from 2.8V to 3.6V
- TLV70033:3.3V
- TLV70033DSE
- DEBUG
- Texas Instruments

## Power pins joined to a net without a drawn wire
P2.3/TA0.0/UCA1STE/A6/C10: MSP1.63(P2.3/TA0.0/UCA1STE/A6/C10)
P2.4/TA1.0/UCA1CLK/A7/C11: MSP1.64(P2.4/TA1.0/UCA1CLK/A7/C11)
P2.7: MSP1.62(P2.7)
P4.5: MSP1.58(P4.5)
P4.6: MSP1.59(P4.6)
P5.4/UCA2TXD/UCA2SIMO/TB0OUTH: MSP1.65(P5.4/UCA2TXD/UCA2SIMO/TB0OUTH)
P6.4/UCB3SIMO/UCB3SDA: MSP1.69(P6.4/UCB3SIMO/UCB3SDA)
P6.5/UCB3SOMI/UCB3SCL: MSP1.70(P6.5/UCB3SOMI/UCB3SCL)
P6.6/UCB3CLK: MSP1.71(P6.6/UCB3CLK)
P6.7/UCB3STE: MSP1.72(P6.7/UCB3STE)
P7.4/TA4.0/A16: MSP1.27(P7.4/TA4.0/A16)
P7.5/A17: MSP1.28(P7.5/A17)
P7.6/A18: MSP1.29(P7.6/A18)
P7.7/A19: MSP1.30(P7.7/A19)
PJ.0/TDO/TB0OUTH/SMCLK/SRSCG1/C6: MSP1.21(PJ.0/TDO/TB0OUTH/SMCLK/SRSCG1/C6)
PJ.1/TDI/TCLK/MCLK/SRSCG0/C7: MSP1.22(PJ.1/TDI/TCLK/MCLK/SRSCG0/C7)
PJ.2/TMS/ACLK/SROSCOFF/C8: MSP1.23(PJ.2/TMS/ACLK/SROSCOFF/C8)
PJ.3/TCK/SRCPUOFF/C9: MSP1.24(PJ.3/TCK/SRCPUOFF/C9)

## Library data of the parts
C1 = MSP430_CapResistor:PANASONIC_SUPERCAP
C2-C9 C12 C13 C101-C103 C105 C107 C108 C110-C125 = rcl:C-EU: CAPACITOR, European symbol
C10 C11 C104 C106 C109 = rcl:CPOL-EU: POLARIZED CAPACITOR, European symbol
D101 D102 = MSP430G6_LP:BAS40-05W
IC101 = roy:TLV70033DSE: 200-mA, Low-I Q , Low-Dropout Regulator for Portable Devices
IC102 = eZFET:TPD4E004
IC103 = roy:TS5A21366RSER: 0.75-Ω DUAL SPST ANALOG SWITCH WITH 1.8-V COMPATIBLE INPUT LOGIC
J1 = LaunchPad_Template_Library:BP_HEADERS_J1
J2 = LaunchPad_Template_Library:BP_HEADERS_J2
J3 = LaunchPad_Template_Library:BP_HEADERS_J3
J4 = LaunchPad_Template_Library:BP_HEADERS_J4
J5 = LaunchPad_Template_Library:BP_HEADERS_PWR_3V3; CCO: 258-0001299; DESCRIPTION: CONN HEADER .100 SINGL STR 3POS; MAN: SULLINS
J6 = LaunchPad_Template_Library:BP_HEADERS_PWR_5V
J7 = MSP430_Headers:JUMPER1X02
J8 = MSP430_Headers:JUMPER1X03
J101 = LaunchPad_Template_Library:J101_2X7_HEADER
J102 = MSP-EXP430G6021:EZFET_MINI-USB-: MINI USB Connector Source: http://www.hirose.co.jp/cataloge_hp/e24000019.pdf
L101 = rcl:L-EU: INDUCTOR, European symbol
LED1 LED2 LED101 LED102 = launchpad:CHIP-LED
MSP1 = MSP_IC:MSP430FR5994
MSP101 = TI_MSP430_v16:F55[0/1/2]X---RGC64: ***F55[0/1/2]X***RGC64 Rev. 1.0 06/2010 "http://www.ti.com/lit/gpn/msp430f5529" "http://www.ti.com/lit/gpn/msp430f5509" F5513/F5514 with limited Functions on some Pins
MSP102 = TI_MSP430_v16:G2X[1/5]2---RSA16: MSP430G2X[1/5]2 MSP430G2x52, MSP430G2x12 QFN (RSA) 16 Pin Package http://focus.ti.com/docs/prod/folders/print/msp430g2452.html
Q1 = MSP_IC:LF_CRYSTAL
Q2 = MSP_Crystals:CRYSTAL
Q101 = MSP430G6_LP:CSTCR4M
R1 = rcl:R-EU_: RESISTOR, European symbol
R2-R5 R7 R101-R109 R112-R128 = resistor:R-US_: RESISTOR, American symbol
R6 = rcl:R-US_: RESISTOR, American symbol
S1-S3 = electricalmeter:PB: OMRON SWITCH
SD1 = Project7264:SD-502702-003: SD-Micro Card connector, Hersteller Molex, H=1,53mm
T101 = MSP430G6_LP:DMG1013UW
T102 = MSP430G6_LP:BC850CW-115
TP101-TP109 = pinhead:PINHD-1X1: PIN HEADER
U$1 = MSP430_Silkscreen:FR5994_REARSILK_REV1_0
U$2 U$3 U$5 U$6 = MSP-EXP432:MOUNTHOLE_125MIL
U$7 = Mike:MIKE_TM
U$8 = LaunchPad_Template_Library:BP_3PIN_SILK
U$10 = LaunchPad_Template_Library:BP_3PIN_SILK_RT

## Net classes
0 default: width 0.254 mm
1 Ground: width 0.305 mm, drill 0.305 mm, clearance 0.152 mm to class 0, clearance 0.152 mm
2 Power: width 0.406 mm, drill 0.305 mm, clearance 0.152 mm to class 0, clearance 0.152 mm to class 1, clearance 0.152 mm